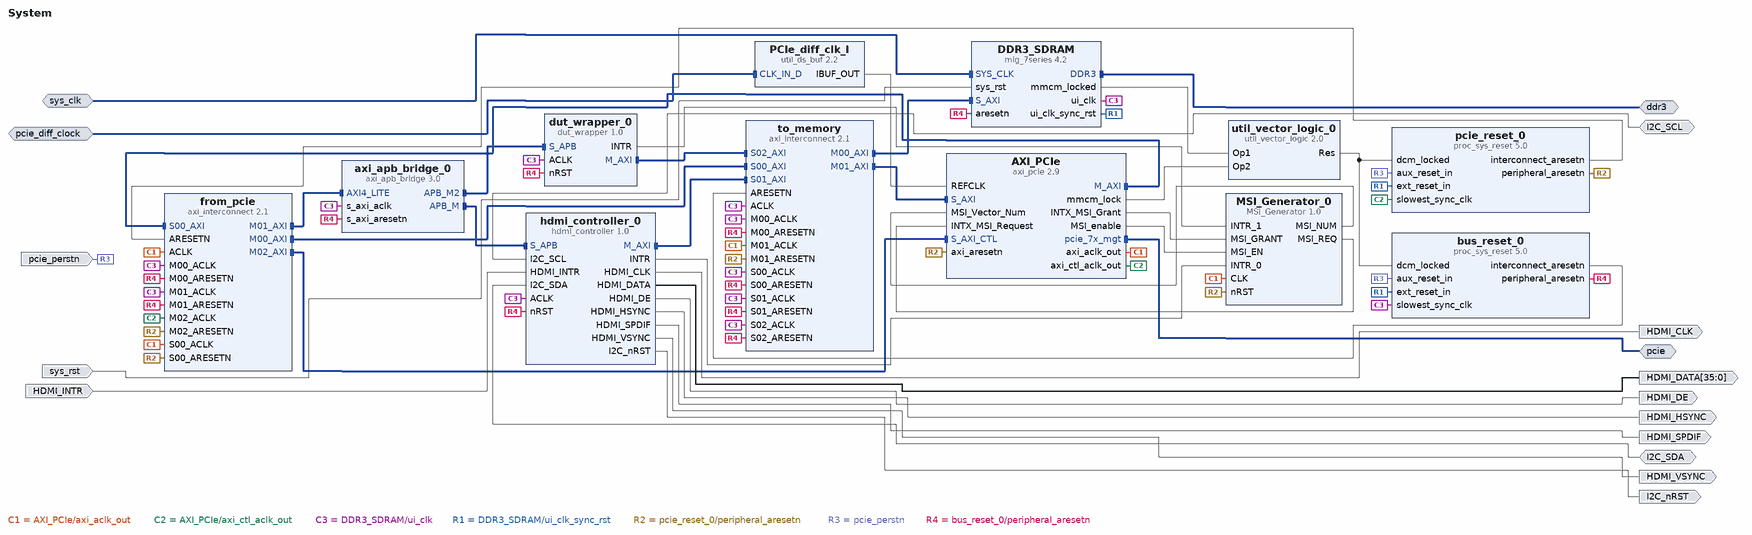
[diagram p0: block diagram of the top level]
# Vivado block design System, xc7vx485tffg1761-2, Vivado 2023.2
create_bd_design System

create_bd_intf_port -mode Master -vlnv xilinx.com:interface:pcie_7x_mgt_rtl:1.0 pcie
create_bd_intf_port -mode Slave -vlnv xilinx.com:interface:diff_clock_rtl:1.0 pcie_diff_clock
create_bd_intf_port -mode Master -vlnv xilinx.com:interface:ddrx_rtl:1.0 ddr3
create_bd_intf_port -mode Slave -vlnv xilinx.com:interface:diff_clock_rtl:1.0 sys_clk
set_property -dict {CONFIG.FREQ_HZ 200000000} [get_bd_intf_ports sys_clk]
create_bd_port -dir I -type rst sys_rst
set_property -dict {CONFIG.POLARITY ACTIVE_HIGH} [get_bd_ports sys_rst]
create_bd_port -dir I -type rst pcie_perstn
create_bd_port -dir O I2C_nRST
create_bd_port -dir IO I2C_SCL
create_bd_port -dir I HDMI_INTR
create_bd_port -dir O HDMI_CLK
create_bd_port -dir O HDMI_DE
create_bd_port -dir O HDMI_HSYNC
create_bd_port -dir O HDMI_VSYNC
create_bd_port -dir O -from 35 -to 0 HDMI_DATA
create_bd_port -dir O HDMI_SPDIF
create_bd_port -dir IO I2C_SDA

create_bd_cell -type ip -vlnv xilinx.com:ip:mig_7series:4.2 DDR3_SDRAM
set_property -dict [list \
  CONFIG.BOARD_MIG_PARAM Custom \
  CONFIG.RESET_BOARD_INTERFACE Custom \
  CONFIG.XML_INPUT_FILE mig_a.prj \
] [get_bd_cells DDR3_SDRAM]
create_bd_cell -type ip -vlnv xilinx.com:ip:proc_sys_reset:5.0 pcie_reset_0
set_property -dict {CONFIG.C_EXT_RST_WIDTH 16} [get_bd_cells pcie_reset_0]
create_bd_cell -type ip -vlnv xilinx.com:ip:proc_sys_reset:5.0 bus_reset_0
set_property -dict {CONFIG.C_EXT_RST_WIDTH 16} [get_bd_cells bus_reset_0]
create_bd_cell -type ip -vlnv xilinx.com:user:dut_wrapper:1.0 dut_wrapper_0
create_bd_cell -type ip -vlnv xilinx.com:user:hdmi_controller:1.0 hdmi_controller_0
create_bd_cell -type ip -vlnv xilinx.com:user:MSI_Generator:1.0 MSI_Generator_0
set_property -dict {CONFIG.INTERRUPT_SIZE 2} [get_bd_cells MSI_Generator_0]
create_bd_cell -type ip -vlnv xilinx.com:ip:util_vector_logic:2.0 util_vector_logic_0
set_property -dict {CONFIG.C_SIZE 1} [get_bd_cells util_vector_logic_0]
create_bd_cell -type ip -vlnv xilinx.com:ip:axi_apb_bridge:3.0 axi_apb_bridge_0
set_property -dict [list \
  CONFIG.C_APB_NUM_SLAVES 2 \
  CONFIG.C_S_AXI_RNG10_BASEADDR 0x0000000090000000 \
  CONFIG.C_S_AXI_RNG10_HIGHADDR 0x000000009FFFFFFF \
  CONFIG.C_S_AXI_RNG11_BASEADDR 0x00000000A0000000 \
  CONFIG.C_S_AXI_RNG11_HIGHADDR 0x00000000AFFFFFFF \
  CONFIG.C_S_AXI_RNG12_BASEADDR 0x00000000B0000000 \
  CONFIG.C_S_AXI_RNG12_HIGHADDR 0x00000000BFFFFFFF \
  CONFIG.C_S_AXI_RNG13_BASEADDR 0x00000000C0000000 \
  CONFIG.C_S_AXI_RNG13_HIGHADDR 0x00000000CFFFFFFF \
  CONFIG.C_S_AXI_RNG14_BASEADDR 0x00000000D0000000 \
  CONFIG.C_S_AXI_RNG14_HIGHADDR 0x00000000DFFFFFFF \
  CONFIG.C_S_AXI_RNG15_BASEADDR 0x00000000E0000000 \
  CONFIG.C_S_AXI_RNG15_HIGHADDR 0x00000000EFFFFFFF \
  CONFIG.C_S_AXI_RNG16_BASEADDR 0x00000000F0000000 \
  CONFIG.C_S_AXI_RNG16_HIGHADDR 0x00000000FFFFFFFF \
  CONFIG.C_S_AXI_RNG3_BASEADDR 0x0000000020000000 \
  CONFIG.C_S_AXI_RNG3_HIGHADDR 0x000000002FFFFFFF \
  CONFIG.C_S_AXI_RNG4_BASEADDR 0x0000000030000000 \
  CONFIG.C_S_AXI_RNG4_HIGHADDR 0x000000003FFFFFFF \
  CONFIG.C_S_AXI_RNG5_BASEADDR 0x0000000040000000 \
  CONFIG.C_S_AXI_RNG5_HIGHADDR 0x000000004FFFFFFF \
  CONFIG.C_S_AXI_RNG6_BASEADDR 0x0000000050000000 \
  CONFIG.C_S_AXI_RNG6_HIGHADDR 0x000000005FFFFFFF \
  CONFIG.C_S_AXI_RNG7_BASEADDR 0x0000000060000000 \
  CONFIG.C_S_AXI_RNG7_HIGHADDR 0x000000006FFFFFFF \
  CONFIG.C_S_AXI_RNG8_BASEADDR 0x0000000070000000 \
  CONFIG.C_S_AXI_RNG8_HIGHADDR 0x000000007FFFFFFF \
  CONFIG.C_S_AXI_RNG9_BASEADDR 0x0000000080000000 \
  CONFIG.C_S_AXI_RNG9_HIGHADDR 0x000000008FFFFFFF \
] [get_bd_cells axi_apb_bridge_0]
create_bd_cell -type ip -vlnv xilinx.com:ip:axi_interconnect:2.1 from_pcie
set_property -dict [list \
  CONFIG.ENABLE_ADVANCED_OPTIONS 1 \
  CONFIG.M01_HAS_REGSLICE 1 \
  CONFIG.NUM_MI 3 \
  CONFIG.SYNCHRONIZATION_STAGES 2 \
  CONFIG.XBAR_DATA_WIDTH 128 \
] [get_bd_cells from_pcie]
create_bd_cell -type ip -vlnv xilinx.com:ip:axi_interconnect:2.1 to_memory
set_property -dict [list \
  CONFIG.ENABLE_ADVANCED_OPTIONS 0 \
  CONFIG.M00_HAS_REGSLICE 0 \
  CONFIG.M01_HAS_REGSLICE 0 \
  CONFIG.M02_HAS_REGSLICE 3 \
  CONFIG.NUM_MI 2 \
  CONFIG.NUM_SI 3 \
  CONFIG.S00_HAS_DATA_FIFO 1 \
  CONFIG.S00_HAS_REGSLICE 0 \
  CONFIG.S01_HAS_DATA_FIFO 1 \
  CONFIG.S02_HAS_DATA_FIFO 1 \
  CONFIG.SYNCHRONIZATION_STAGES 2 \
] [get_bd_cells to_memory]
create_bd_cell -type ip -vlnv xilinx.com:ip:axi_pcie:2.9 AXI_PCIe
set_property -dict [list \
  CONFIG.AXIBAR2PCIEBAR_0 0xD0000000 \
  CONFIG.AXIBAR2PCIEBAR_1 0xD2000000 \
  CONFIG.AXIBAR_AS_0 true \
  CONFIG.AXIBAR_AS_1 true \
  CONFIG.AXIBAR_NUM 2 \
  CONFIG.BAR0_SCALE Megabytes \
  CONFIG.BAR0_SIZE 1 \
  CONFIG.BAR1_ENABLED true \
  CONFIG.BAR1_SCALE Gigabytes \
  CONFIG.BAR1_SIZE 1 \
  CONFIG.BAR1_TYPE Memory \
  CONFIG.BAR_64BIT true \
  CONFIG.DEVICE_ID 0x7022 \
  CONFIG.HIGHADDR 0x00000FFF \
  CONFIG.MAX_LINK_SPEED 5.0_GT/s \
  CONFIG.M_AXI_DATA_WIDTH 128 \
  CONFIG.NO_OF_LANES X4 \
  CONFIG.NUM_MSI_REQ 3 \
  CONFIG.PCIEBAR2AXIBAR_1 0x80000000 \
  CONFIG.SUBSYSTEM_ID 0x2D3D \
  CONFIG.SUBSYSTEM_VENDOR_ID 0xC10E \
  CONFIG.S_AXI_DATA_WIDTH 128 \
  CONFIG.S_AXI_SUPPORTS_NARROW_BURST true \
  CONFIG.XLNX_REF_BOARD VC707 \
] [get_bd_cells AXI_PCIe]
create_bd_cell -type ip -vlnv xilinx.com:ip:util_ds_buf:2.2 PCIe_diff_clk_I
set_property -dict {CONFIG.C_BUF_TYPE IBUFDSGTE CONFIG.DIFF_CLK_IN_BOARD_INTERFACE Custom} [get_bd_cells PCIe_diff_clk_I]

# ---- connections ----

connect_bd_intf_net [get_bd_intf_pins AXI_PCIe/M_AXI] [get_bd_intf_pins from_pcie/S00_AXI]
connect_bd_intf_net [get_bd_intf_ports pcie] [get_bd_intf_pins AXI_PCIe/pcie_7x_mgt]
connect_bd_intf_net [get_bd_intf_ports ddr3] [get_bd_intf_pins DDR3_SDRAM/DDR3]
connect_bd_intf_net [get_bd_intf_ports sys_clk] [get_bd_intf_pins DDR3_SDRAM/SYS_CLK]
connect_bd_intf_net -intf_net axi4_0_M00_AXI [get_bd_intf_pins DDR3_SDRAM/S_AXI] [get_bd_intf_pins to_memory/M00_AXI]
connect_bd_intf_net [get_bd_intf_pins axi_apb_bridge_0/APB_M] [get_bd_intf_pins hdmi_controller_0/S_APB]
connect_bd_intf_net [get_bd_intf_pins dut_wrapper_0/S_APB] [get_bd_intf_pins axi_apb_bridge_0/APB_M2]
connect_bd_intf_net [get_bd_intf_pins dut_wrapper_0/M_AXI] [get_bd_intf_pins to_memory/S02_AXI]
connect_bd_intf_net [get_bd_intf_pins from_pcie/M00_AXI] [get_bd_intf_pins to_memory/S00_AXI]
connect_bd_intf_net [get_bd_intf_pins from_pcie/M01_AXI] [get_bd_intf_pins axi_apb_bridge_0/AXI4_LITE]
connect_bd_intf_net [get_bd_intf_pins from_pcie/M02_AXI] [get_bd_intf_pins AXI_PCIe/S_AXI_CTL]
connect_bd_intf_net [get_bd_intf_pins hdmi_controller_0/M_AXI] [get_bd_intf_pins to_memory/S01_AXI]
connect_bd_intf_net -intf_net pcie_diff_clk_1 [get_bd_intf_ports pcie_diff_clock] [get_bd_intf_pins PCIe_diff_clk_I/CLK_IN_D]
connect_bd_intf_net [get_bd_intf_pins to_memory/M01_AXI] [get_bd_intf_pins AXI_PCIe/S_AXI]
connect_bd_net -net ARESETN_1 [get_bd_pins pcie_reset_0/interconnect_aresetn] [get_bd_pins from_pcie/ARESETN]
connect_bd_net [get_bd_pins AXI_PCIe/INTX_MSI_Grant] [get_bd_pins MSI_Generator_0/MSI_GRANT]
connect_bd_net [get_bd_pins AXI_PCIe/MSI_enable] [get_bd_pins MSI_Generator_0/MSI_EN]
connect_bd_net [get_bd_pins AXI_PCIe/axi_aclk_out] \
  [get_bd_pins MSI_Generator_0/CLK] [get_bd_pins from_pcie/ACLK] [get_bd_pins from_pcie/S00_ACLK] \
  [get_bd_pins to_memory/M01_ACLK]
connect_bd_net [get_bd_pins AXI_PCIe/axi_ctl_aclk_out] [get_bd_pins from_pcie/M02_ACLK] [get_bd_pins pcie_reset_0/slowest_sync_clk]
connect_bd_net [get_bd_pins AXI_PCIe/mmcm_lock] [get_bd_pins util_vector_logic_0/Op2]
connect_bd_net [get_bd_pins DDR3_SDRAM/mmcm_locked] [get_bd_pins util_vector_logic_0/Op1]
connect_bd_net [get_bd_pins DDR3_SDRAM/ui_clk] \
  [get_bd_pins dut_wrapper_0/ACLK] [get_bd_pins hdmi_controller_0/ACLK] [get_bd_pins axi_apb_bridge_0/s_axi_aclk] \
  [get_bd_pins from_pcie/M00_ACLK] [get_bd_pins from_pcie/M01_ACLK] [get_bd_pins to_memory/ACLK] \
  [get_bd_pins to_memory/S00_ACLK] [get_bd_pins to_memory/S01_ACLK] [get_bd_pins to_memory/S02_ACLK] \
  [get_bd_pins to_memory/M00_ACLK] [get_bd_pins bus_reset_0/slowest_sync_clk]
connect_bd_net [get_bd_pins DDR3_SDRAM/ui_clk_sync_rst] [get_bd_pins pcie_reset_0/ext_reset_in] [get_bd_pins bus_reset_0/ext_reset_in]
connect_bd_net [get_bd_ports HDMI_INTR] [get_bd_pins hdmi_controller_0/HDMI_INTR]
connect_bd_net [get_bd_pins MSI_Generator_0/MSI_NUM] [get_bd_pins AXI_PCIe/MSI_Vector_Num]
connect_bd_net [get_bd_pins MSI_Generator_0/MSI_REQ] [get_bd_pins AXI_PCIe/INTX_MSI_Request]
connect_bd_net [get_bd_ports I2C_SCL] [get_bd_pins hdmi_controller_0/I2C_SCL]
connect_bd_net [get_bd_ports I2C_SDA] [get_bd_pins hdmi_controller_0/I2C_SDA]
connect_bd_net [get_bd_pins PCIe_diff_clk_I/IBUF_OUT] [get_bd_pins AXI_PCIe/REFCLK]
connect_bd_net -net S00_ARESETN_1 [get_bd_pins pcie_reset_0/peripheral_aresetn] \
  [get_bd_pins MSI_Generator_0/nRST] [get_bd_pins from_pcie/S00_ARESETN] [get_bd_pins from_pcie/M02_ARESETN] \
  [get_bd_pins to_memory/M01_ARESETN] [get_bd_pins AXI_PCIe/axi_aresetn]
connect_bd_net [get_bd_pins dut_wrapper_0/INTR] [get_bd_pins MSI_Generator_0/INTR_1]
connect_bd_net [get_bd_pins hdmi_controller_0/HDMI_CLK] [get_bd_ports HDMI_CLK]
connect_bd_net [get_bd_pins hdmi_controller_0/HDMI_DATA] [get_bd_ports HDMI_DATA]
connect_bd_net [get_bd_pins hdmi_controller_0/HDMI_DE] [get_bd_ports HDMI_DE]
connect_bd_net [get_bd_pins hdmi_controller_0/HDMI_HSYNC] [get_bd_ports HDMI_HSYNC]
connect_bd_net [get_bd_pins hdmi_controller_0/HDMI_SPDIF] [get_bd_ports HDMI_SPDIF]
connect_bd_net [get_bd_pins hdmi_controller_0/HDMI_VSYNC] [get_bd_ports HDMI_VSYNC]
connect_bd_net [get_bd_pins hdmi_controller_0/I2C_nRST] [get_bd_ports I2C_nRST]
connect_bd_net [get_bd_pins hdmi_controller_0/INTR] [get_bd_pins MSI_Generator_0/INTR_0]
connect_bd_net [get_bd_ports pcie_perstn] [get_bd_pins pcie_reset_0/aux_reset_in] [get_bd_pins bus_reset_0/aux_reset_in]
connect_bd_net -net reset_1 [get_bd_ports sys_rst] [get_bd_pins DDR3_SDRAM/sys_rst]
connect_bd_net -net rst_DDR3_SDRAM_200M_interconnect_aresetn [get_bd_pins bus_reset_0/interconnect_aresetn] [get_bd_pins to_memory/ARESETN]
connect_bd_net -net rst_DDR3_SDRAM_200M_peripheral_aresetn [get_bd_pins bus_reset_0/peripheral_aresetn] \
  [get_bd_pins DDR3_SDRAM/aresetn] [get_bd_pins dut_wrapper_0/nRST] [get_bd_pins hdmi_controller_0/nRST] \
  [get_bd_pins axi_apb_bridge_0/s_axi_aresetn] [get_bd_pins from_pcie/M00_ARESETN] [get_bd_pins from_pcie/M01_ARESETN] \
  [get_bd_pins to_memory/S00_ARESETN] [get_bd_pins to_memory/S01_ARESETN] [get_bd_pins to_memory/S02_ARESETN] \
  [get_bd_pins to_memory/M00_ARESETN]
connect_bd_net [get_bd_pins util_vector_logic_0/Res] [get_bd_pins pcie_reset_0/dcm_locked] [get_bd_pins bus_reset_0/dcm_locked]

# ---- address map ----
assign_bd_address -offset 0x00000000 -range 64K -target_address_space [get_bd_addr_spaces AXI_PCIe/M_AXI] [get_bd_addr_segs AXI_PCIe/S_AXI_CTL/CTL0]
assign_bd_address -offset 0x00010000 -range 64K -target_address_space [get_bd_addr_spaces AXI_PCIe/M_AXI] [get_bd_addr_segs hdmi_controller_0/S_APB/S_APB]
assign_bd_address -offset 0x00020000 -range 64K -target_address_space [get_bd_addr_spaces AXI_PCIe/M_AXI] [get_bd_addr_segs dut_wrapper_0/S_APB/S_APB]
assign_bd_address -offset 0x40000000 -range 32M -target_address_space [get_bd_addr_spaces AXI_PCIe/M_AXI] [get_bd_addr_segs AXI_PCIe/S_AXI/BAR0]
assign_bd_address -offset 0x42000000 -range 32M -target_address_space [get_bd_addr_spaces AXI_PCIe/M_AXI] [get_bd_addr_segs AXI_PCIe/S_AXI/BAR1]
assign_bd_address -offset 0x80000000 -range 1G -target_address_space [get_bd_addr_spaces AXI_PCIe/M_AXI] [get_bd_addr_segs DDR3_SDRAM/memmap/memaddr]

validate_bd_design
save_bd_design
